# EAGLE schematic main (EAGLE 6.1)
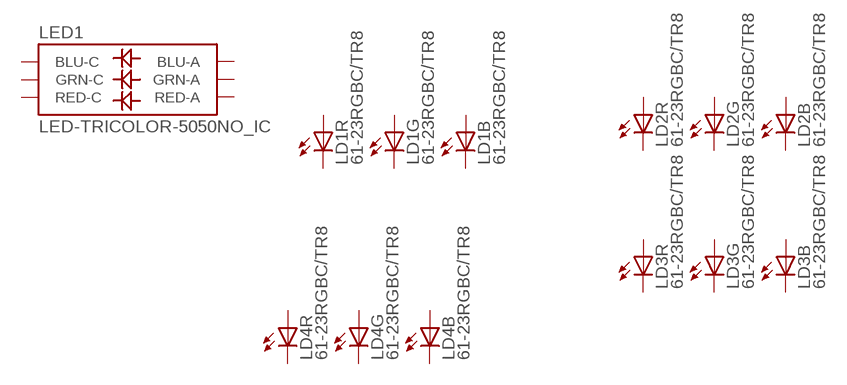
[diagram p0: schematic, sheet 1]

## Parts
LD1  61-23RGBC/TR8  [PLCC6]
LD2  61-23RGBC/TR8  [PLCC6]
LD3  61-23RGBC/TR8  [PLCC6]
LD4  61-23RGBC/TR8  [PLCC6]
LED1  LED-TRICOLOR-5050NO_IC  [LED-TRICOLOR-5050]
Unconnected: LD1.1(B:C) LD1.2(R:C) LD1.3(G:C) LD1.4(G:A) LD1.5(R:A) LD1.6(B:A) LD2.1(B:C) LD2.2(R:C) LD2.3(G:C) LD2.4(G:A) LD2.5(R:A) LD2.6(B:A) LD3.1(B:C) LD3.2(R:C) LD3.3(G:C) LD3.4(G:A) LD3.5(R:A) LD3.6(B:A) LD4.1(B:C) LD4.2(R:C) LD4.3(G:C) LD4.4(G:A) LD4.5(R:A) LD4.6(B:A) LED1.1(GRN-A) LED1.2(RED-A) LED1.3(BLU-A) LED1.4(BLU-C) LED1.5(RED-C) LED1.6(GRN-C)

## Library data of the parts
LD1-LD4 = everlight:61-23RGBC/TR8: Luminosity Full Color LED
LED1 = SparkFun-LED:LED-TRICOLOR-5050